# EAGLE schematic Lcd (EAGLE 6.5.0)
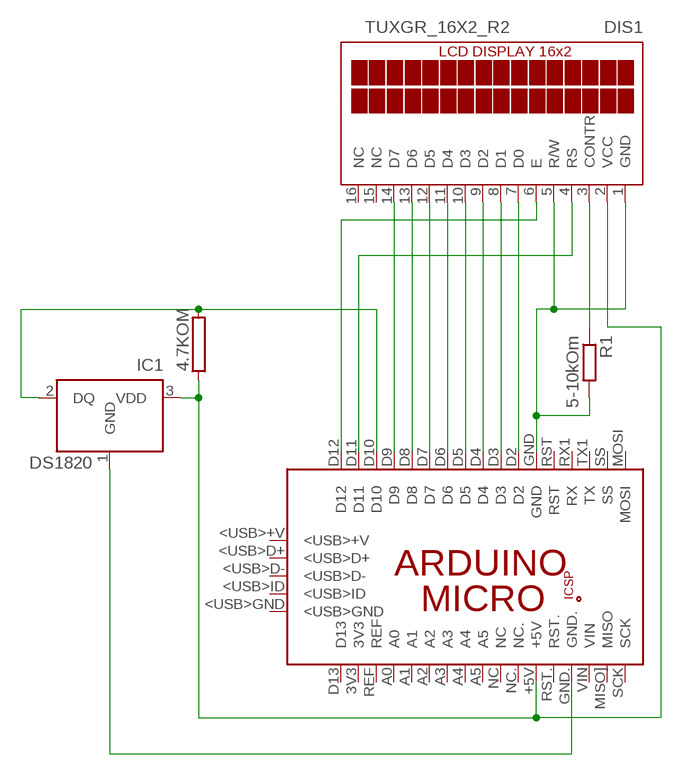
[diagram p0: schematic, sheet 1]

## Parts
4.7KOM  RCA4055  [CA4055]
DIS1  TUXGR_16X2_R2  [TUXGR_16X2_R2]
IC1  DS1820  [TO-92]
PCB1  ARDUINO_MICRO  [ARDUINO_MICRO]
R1  5-10kOm  R-EU_0204/7  [0204/7]

## Nets
N$1: DIS1.7(D0) PCB1.D2
N$2: DIS1.8(D1) PCB1.D3
N$3: DIS1.9(D2) PCB1.D4
N$4: DIS1.10(D3) PCB1.D5
N$5: DIS1.11(D4) PCB1.D6
N$6: DIS1.12(D5) PCB1.D7
N$7: DIS1.13(D6) PCB1.D8
N$8: DIS1.14(D7) PCB1.D9
N$9: DIS1.1(GND) DIS1.5(R/W) PCB1.GND R1.2
N$10: 4.7KOM.1 DIS1.2(VCC) IC1.3(VDD) PCB1.+5V
N$11: DIS1.3(CONTR) R1.1
N$12: IC1.1(GND) PCB1.GND.
N$13: DIS1.6(E) PCB1.D12
N$14: DIS1.4(RS) PCB1.D11
N$16: 4.7KOM.2 IC1.2(DQ) PCB1.D10
Unconnected: DIS1.15(NC) DIS1.16(NC) PCB1.3V3 PCB1.5V PCB1.<USB>+V PCB1.<USB>D+ PCB1.<USB>D- PCB1.<USB>GND PCB1.<USB>ID PCB1.A0 PCB1.A1 PCB1.A2 PCB1.A3 PCB1.A4 PCB1.A5 PCB1.D13 PCB1.GND_ PCB1.MISO. PCB1.MISO](MISO) PCB1.MOSI PCB1.MOSI. PCB1.NC PCB1.NC. PCB1.REF PCB1.RESET.. PCB1.RST PCB1.RST. PCB1.RX1(RX) PCB1.SCK PCB1.SCK. PCB1.SS PCB1.TX1(TX) PCB1.VIN

## Library data of the parts
4.7KOM = resistor-power:R: Power Resitor; OC_FARNELL: unknown; OC_NEWARK: unknown
DIS1 = display-lcd:TUXGR_16X2_R2: Tuxgraphics LCD display 16x2 characters reflective, without background light Source: tuxgr_12x2_r2.pdf; OC_FARNELL: unknown; OC_NEWARK: unknown
IC1 = ds1820:DS1820: DS1820 - 1-Wire Digital Thermometer
PCB1 = E14_Arduino:ARDUINO_MICRO: Device for representing an Arduino Micro board with a footprint in an EAGLE design. Created by Dave Young for Element14. More EAGLE documentation at: http://www.element14.com/community/community/knode/cadsoft_eagle
R1 = resistor:R-EU_: RESISTOR, European symbol